# EAGLE design K10 reg proto (EAGLE 6.5.0)
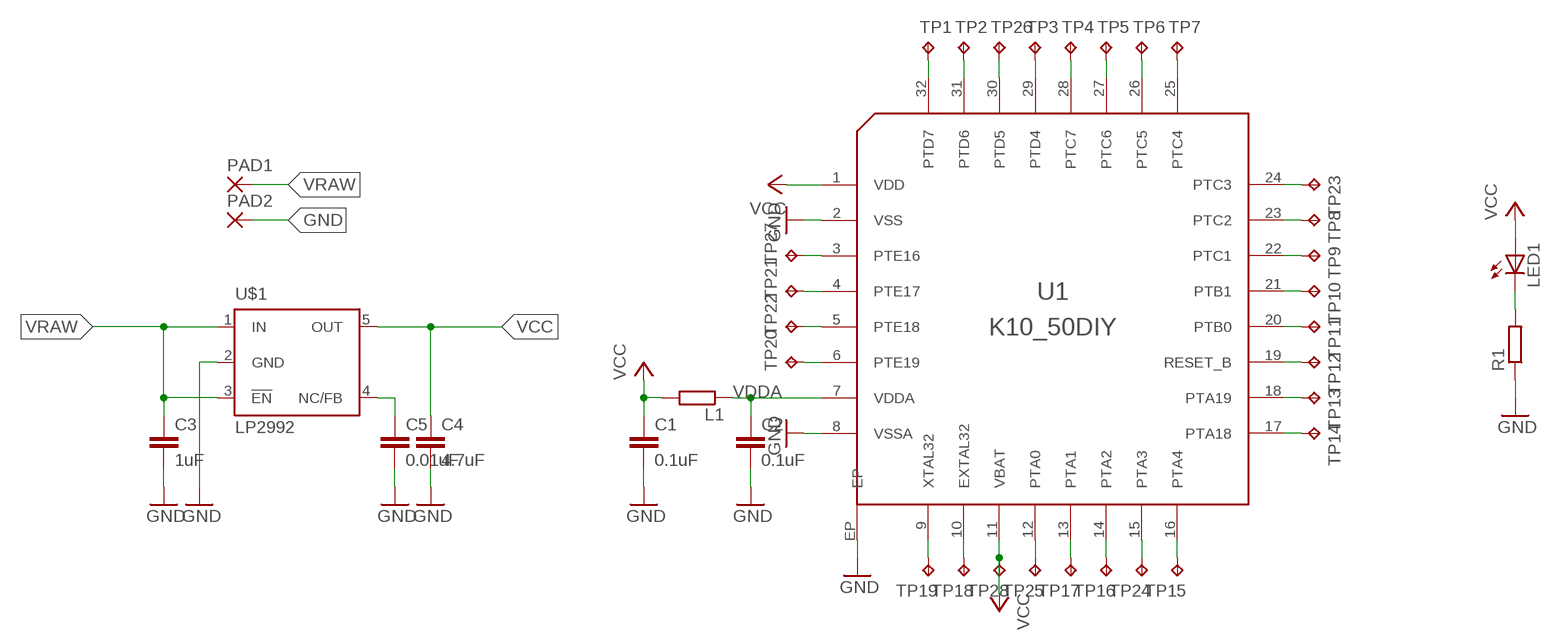
[diagram p0: schematic, sheet 1]

## Parts
C1  0.1uF  C-EUC0805  [C0805]
C2  0.1uF  C-EUC0805  [C0805]
C3  1uF  C-EUC0805  [C0805]
C4  4.7uF  C-EUC0805  [C0805]
C5  0.01uF  C-EUC0805  [C0805]
L1  R-EU_R1206  [R1206]
LED1  LEDSML0805  [SML0805]
PAD1  SMD2  [SMD1,27-2,54]
PAD2  SMD2  [SMD1,27-2,54]
R1  R-EU_R0805  [R0805]
TP1  TPTP06R  [TP06R]
TP2  TPTP06R  [TP06R]
TP3  TPTP06R  [TP06R]
TP4  TPTP06R  [TP06R]
TP5  TPTP06R  [TP06R]
TP6  TPTP06R  [TP06R]
TP7  TPTP06R  [TP06R]
TP8  TPTP06R  [TP06R]
TP9  TPTP06R  [TP06R]
TP10  TPTP06R  [TP06R]
TP11  TPTP06R  [TP06R]
TP12  TPTP06R  [TP06R]
TP13  TPTP06R  [TP06R]
TP14  TPTP06R  [TP06R]
TP15  TPTP06R  [TP06R]
TP16  TPTP06R  [TP06R]
TP17  TPTP06R  [TP06R]
TP18  TPTP06R  [TP06R]
TP19  TPTP06R  [TP06R]
TP20  TPTP06R  [TP06R]
TP21  TPTP06R  [TP06R]
TP22  TPTP06R  [TP06R]
TP23  TPTP06R  [TP06R]
TP24  TPTP06R  [TP06R]
TP25  TPTP06R  [TP06R]
TP26  TPTP06R  [TP06R]
TP27  TPTP06R  [TP06R]
TP28  TPTP06R  [TP06R]
U1  K10_50DIY  [QFN32-DIY]
U$1  LP2992  [SOT-23DBV]

## Nets
3: TP27.TP U1.3(PTE16)
4: TP21.TP U1.4(PTE17)
6: TP20.TP U1.6(PTE19)
9: TP19.TP U1.9(XTAL32)
10: TP18.TP U1.10(EXTAL32)
12: TP25.TP U1.12(PTA0)
13: TP17.TP U1.13(PTA1)
14: TP16.TP U1.14(PTA2)
15: TP24.TP U1.15(PTA3)
16: TP15.TP U1.16(PTA4)
17: TP14.TP U1.17(PTA18)
18: TP13.TP U1.18(PTA19)
19: TP12.TP U1.19(RESET_B)
20: TP11.TP U1.20(PTB0)
21: TP10.TP U1.21(PTB1)
22: TP9.TP U1.22(PTC1)
23: TP8.TP U1.23(PTC2)
24: TP23.TP U1.24(PTC3)
25: TP7.TP U1.25(PTC4)
26: TP6.TP U1.26(PTC5)
27: TP5.TP U1.27(PTC6)
28: TP4.TP U1.28(PTC7)
29: TP3.TP U1.29(PTD4)
31: TP2.TP U1.31(PTD6)
32: TP1.TP U1.32(PTD7)
GND: C1.2 C2.2 C3.2 C4.2 C5.2 PAD2.1(P) R1.1 U1.2(VSS) U1.8(VSSA) U1.EP U$1.2(GND)
MIC: TP22.TP U1.5(PTE18)
N$1: LED1.C R1.2
N$3: C5.1 U$1.4(NC/FB)
N$4: TP26.TP U1.30(PTD5)
VCC: C1.1 C4.1 L1.2 LED1.A TP28.TP U1.1(VDD) U1.11(VBAT) U$1.5(OUT)
VDDA: C2.1 L1.1 U1.7(VDDA)
VRAW: C3.1 PAD1.1(P) U$1.1(IN) U$1.3(!EN)

## Library data of the parts
C1-C5 = rcl:C-EU: CAPACITOR, European symbol
L1 R1 = rcl:R-EU_: RESISTOR, European symbol
LED1 = led:LED: LED OSRAM: - CHIPLED LG R971, LG N971, LY N971, LG Q971, LY Q971, LO R971, LY R971 LH N974, LH R974 LS Q976, LO Q976, LY Q976 LO Q996 - Hyper CHIPLED LW Q18S LB Q993, LB Q99A, LB R99A - SideLED LS A670, LO A670, LY A670, LG A670, LP A670 LB A673, LV A673, LT A673, LW A673 LH A674 LY A675 LS A676, LA A676, LO A676, LY A676, LW A676 LS A679, LY A679, LG A679 - Hyper Micro SIDELED® LS Y876, LA Y876, LO Y876, LY Y876 LT Y87S - SmartLED LW L88C, LW L88S LB L89C, LB L89S, LG L890 LS L89K, LO L89K, LY L89K LS L896, LA L896, LO L896, LY L896 - TOPLED LS T670, LO T670, LY T670, LG T670, LP T670 LSG T670, LSP T670, LSY T670, LOP T670, LYG T670 LG T671, LOG T671, LSG T671 LB T673, LV T673, LT T673, LW T673 LH T674 LS T676, LA T676, LO T676, LY T676, LB T676, LH T676, LSB T676, LW T676 LB T67C, LV T67C, LT T67C, LS T67K, LO T67K, LY T67K, LW E67C LS E67B, LA E67B, LO E67B, LY E67B, LB E67C, LV E67C, LT E67C LW T67C LS T679, LY T679, LG T679 LS T770, LO T770, LY T770, LG T770, LP T770 LB T773, LV T773, LT T773, LW T773 LH T774 LS E675, LA E675, LY E675, LS T675 LS T776, LA T776, LO T776, LY T776, LB T776 LHGB T686 LT T68C, LB T68C - Hyper Mini TOPLED® LB M676 - Mini TOPLED Santana® LG M470 LS M47K, LO M47K, LY M47K Source: http://www.osram.convergy.de LUXEON: - LUMILED® LXK2-PW12-R00, LXK2-PW12-S00, LXK2-PW14-U00, LXK2-PW14-V00 LXK2-PM12-R00, LXK2-PM12-S00, LXK2-PM14-U00 LXK2-PE12-Q00, LXK2-PE12-R00, LXK2-PE12-S00, LXK2-PE14-T00, LXK2-PE14-U00 LXK2-PB12-K00, LXK2-PB12-L00, LXK2-PB12-M00, LXK2-PB14-N00, LXK2-PB14-P00, LXK2-PB14-Q00 LXK2-PR12-L00, LXK2-PR12-M00, LXK2-PR14-Q00, LXK2-PR14-R00 LXK2-PD12-Q00, LXK2-PD12-R00, LXK2-PD12-S00 LXK2-PH12-R00, LXK2-PH12-S00 LXK2-PL12-P00, LXK2-PL12-Q00, LXK2-PL12-R00 Source: www.luxeon.com KINGBRIGHT: KA-3528ASYC Source: www.kingbright.com
PAD1 PAD2 = wirepad:SMD2: SMD PAD
TP1-TP28 = testpad:TP: Test pad
U1 = alex:K10_50
U$1 = alex:LP2992

## Board
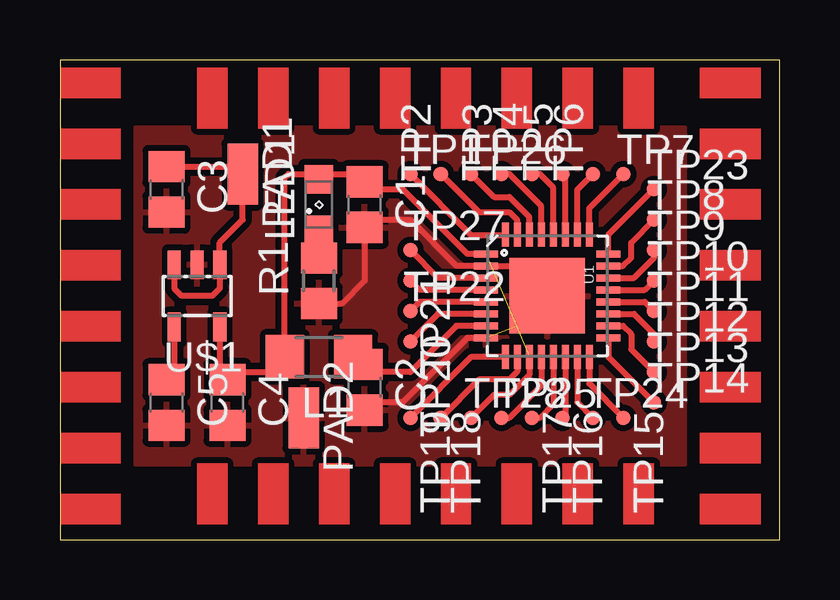
[diagram p1: board, top side]
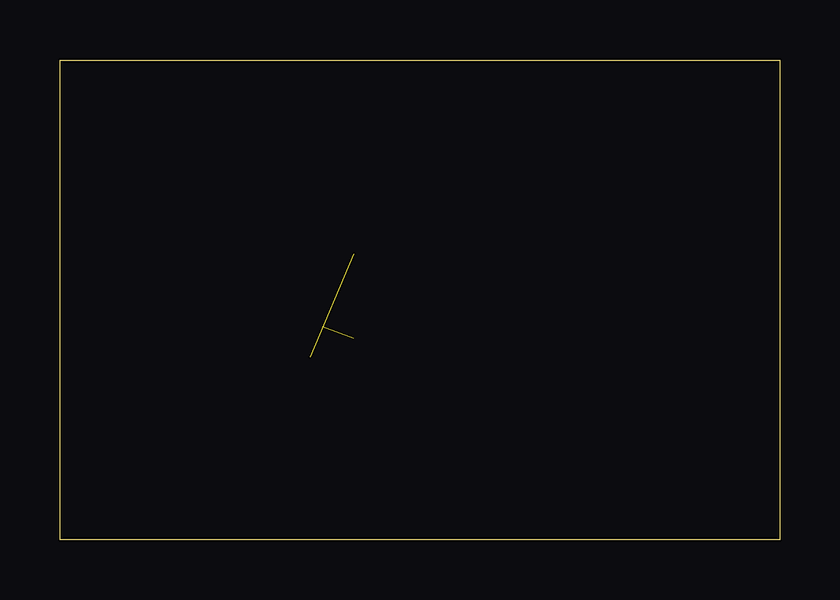
[diagram p2: board, bottom side, seen from below]

Size 30 x 20 mm. Coordinates in mm from the lower left corner, seen from the top.
Outline: 0,0 30,0 30,20 0,20 0,0
Copper layers (1*16): Top 0.035mm / dielectric 1.5mm / Bottom 0.035mm
Design rules "default *": minimum track width 10mil, minimum drill 24mil, track to track 8mil, track to pad 8mil, pad to pad 8mil, via to via 8mil, smd to smd 8mil, copper to edge 0mil, drill to drill 8mil, minimum pad ring 10mil, minimum via ring 8mil, stop-mask expansion 4mil, vias tented up to drill 0mil, thermal gap 10mil
tRestrict: area 19,11 to 21,12

### Footprints (pad centres in the part's own frame; a part is rotated, then mirrored left to right if it is on the bottom)
C0805 = smd 1.3 x 1.5: 1 -0.95,0; 2 0.95,0
R1206 = smd 1.6 x 1.803: 1 -1.422,0; 2 1.422,0
SML0805 = smd 1.2 x 1.2: A 1.05,0; C -1.05,0
SMD1,27-2,54 = smd 1.27 x 2.54: 1 0,0
R0805 = smd 1.3 x 1.5: 1 -0.95,0; 2 0.95,0
TP06R = smd 0.6 x 0.6: TP 0,0
QFN32-DIY = smd 1 x 0.28: 1 -2.55,1.75; 2 -2.55,1.25; 3 -2.55,0.75; 4 -2.55,0.25; 5 -2.55,-0.25; 6 -2.55,-0.75; 7 -2.55,-1.25; 8 -2.55,-1.75; 17 2.55,-1.75; 18 2.55,-1.25; 19 2.55,-0.75; 20 2.55,-0.25; 21 2.55,0.25; 22 2.55,0.75; 23 2.55,1.25; 24 2.55,1.75 | smd 0.28 x 1: 9 -1.75,-2.55; 10 -1.25,-2.55; 11 -0.75,-2.55; 12 -0.25,-2.55; 13 0.25,-2.55; 14 0.75,-2.55; 15 1.25,-2.55; 16 1.75,-2.55; 25 1.75,2.55; 26 1.25,2.55; 27 0.75,2.55; 28 0.25,2.55; 29 -0.25,2.55; 30 -0.75,2.55; 31 -1.25,2.55; 32 -1.75,2.55 | smd 3.15 x 3.15: EP 0,0
SOT-23DBV = smd 0.55 x 1.2: 1 -0.95,-1.3; 2 0,-1.3; 3 0.95,-1.3; 4 0.95,1.3; 5 -0.95,1.3

### Placement (x,y rotation side)
C1  12.7,13.97 270 top
C2  12.7,6.35 270 top
C3  4.45,14.61 270 top
C4  6.99,5.71 270 top
C5  4.45,5.71 270 top
L1  10.79,7.62 180 top
LED1  10.79,13.97 90 top
PAD1  7.62,15.24 180 top
PAD2  10.16,5.08 180 top
R1  10.79,10.79 90 top
TP1  14.61,15.24 0 top
TP2  15.88,15.24 90 top
TP3  18.41,15.24 90 top
TP4  19.68,15.24 90 top
TP5  20.95,15.24 90 top
TP6  22.23,15.24 90 top
TP7  23.5,15.24 0 top
TP8  24.77,13.34 0 top
TP9  24.77,12.06 0 top
TP10  24.77,10.79 0 top
TP11  24.77,9.53 0 top
TP12  24.77,8.26 0 top
TP13  24.77,6.99 0 top
TP14  24.77,5.71 0 top
TP15  23.5,5.08 270 top
TP16  20.95,5.08 270 top
TP17  19.68,5.08 270 top
TP18  15.88,5.08 270 top
TP19  14.61,5.08 270 top
TP20  14.61,8.26 270 top
TP21  14.61,10.79 270 top
TP22  14.61,9.53 0 top
TP23  24.77,14.61 0 top
TP24  22.23,5.08 0 top
TP25  18.41,5.08 0 top
TP26  17.14,15.24 0 top
TP27  14.61,12.06 0 top
TP28  17.14,5.08 0 top
U1  20.32,10.16 0 top
U$1  5.71,10.16 180 top

### Tracks (layer width: path | path; a pad name or v marks a point on that pad's centre or on a via)
3
  Top 0.254: U1.3 15.76,10.91 TP27.TP
4
  Top 0.254: U1.4 14.99,10.41 TP21.TP
6
  Top 0.254: U1.6 15.76,9.41 TP20.TP
9
  Top 0.254: U1.9 17.14,7.61 TP19.TP
10
  Top 0.254: U1.10 19.07,7 18.73,6.67 17.46,6.67 TP18.TP
12
  Top 0.254: TP25.TP 18.73,5.08 20.07,6.42 U1.12
13
  Top 0.254: TP17.TP 20,5.08 20.57,5.65 U1.13
14
  Top 0.254: U1.14 21.07,5.2 TP16.TP
15
  Top 0.254: U1.15 21.57,5.74 TP24.TP
16
  Top 0.254: U1.16 22.07,6.5 TP15.TP
17
  Top 0.254: U1.17 22.87,7.61 TP14.TP
18
  Top 0.254: U1.18 23.48,8.91 23.81,8.57 23.81,7.94 TP13.TP
19
  Top 0.254: U1.19 23.93,9.41 24.77,8.57 TP12.TP
20
  Top 0.254: U1.20 24.38,9.91 TP11.TP
21
  Top 0.254: U1.21 24.38,10.41 TP10.TP
22
  Top 0.254: U1.22 23.93,10.91 24.77,11.75 TP9.TP
23
  Top 0.254: U1.23 23.48,11.41 23.81,11.75 23.81,12.38 TP8.TP
24
  Top 0.254: U1.24 22.87,12.71 TP23.TP
25
  Top 0.254: U1.25 22.07,13.81 TP7.TP
26
  Top 0.254: U1.26 21.57,14.59 TP6.TP
27
  Top 0.254: U1.27 21.07,15.12 TP5.TP
28
  Top 0.254: TP4.TP 20,15.24 20.57,14.67 U1.28
29
  Top 0.254: TP3.TP 18.73,15.24 20.07,13.9 U1.29
31
  Top 0.254: TP2.TP 17.46,13.65 18.73,13.65 19.07,13.31 U1.31
32
  Top 0.254: TP1.TP 17.14,12.7 U1.32
GND  (1 unrouted)
  Top 0.254: U1.8 16.98,8.41 14.29,5.71 13.02,5.71 C2.2 13.02,5.4 | C1.2 12.7,13.34 14.61,13.34 16.53,11.41 U1.2 20.3,11.41 20.32,11.43 U1.EP 19.05,8.89 | 12.38,13.34 C1.2 | C1.2 12.7,10.79 11.75,9.85 R1.1
  pour Top (isolate 0.254): 3.17,17.14 3.17,3.17 26.04,3.17 26.04,17.14
MIC
  Top 0.254: U1.5 14.99,9.91 TP22.TP
N$1
  Top 0.254: R1.2 LED1.C
N$3
  Top 0.254: U$1.4 4.76,6.99 C5.1
N$4
  Top 0.254: TP26.TP 18.1,14.29 18.73,14.29 19.57,13.45 U1.30
VCC  (1 unrouted)
  Top 0.254: U1.11 19.57,6.87 18.73,6.03 18.1,6.03 TP28.TP | U1.1 16.98,11.91 14.29,14.61 12.7,14.61 C1.1 12.38,15.24 10.79,15.24 | L1.2 9.37,15.09 9.53,15.24 10.79,15.24 | L1.2 9.37,7.47 | 10.79,15.24 LED1.A 10.89,14.92 10.89,15.14 10.79,15.24 | U$1.5 6.67,6.99 C4.1 6.99,6.99 8.74,6.99 L1.2
VDDA
  Top 0.254: U1.7 16.53,8.91 14.61,6.99 13.02,6.99 C2.1 12.06,7.3 L1.1
VRAW
  Top 0.254: U$1.3 4.76,10.47 5.08,10.16 6.35,10.16 6.67,10.47 U$1.1 6.67,12.38 7.62,13.34 PAD1.1 | C3.1 7.3,15.55 PAD1.1 | 7.62,15.88 PAD1.1
(copper drawn outside any net)
  shapes: Top area x32

### Text on the board
Bottom: Additional wire connections required!